# EAGLE schematic Josytick Rev J (EAGLE 9.6.2)
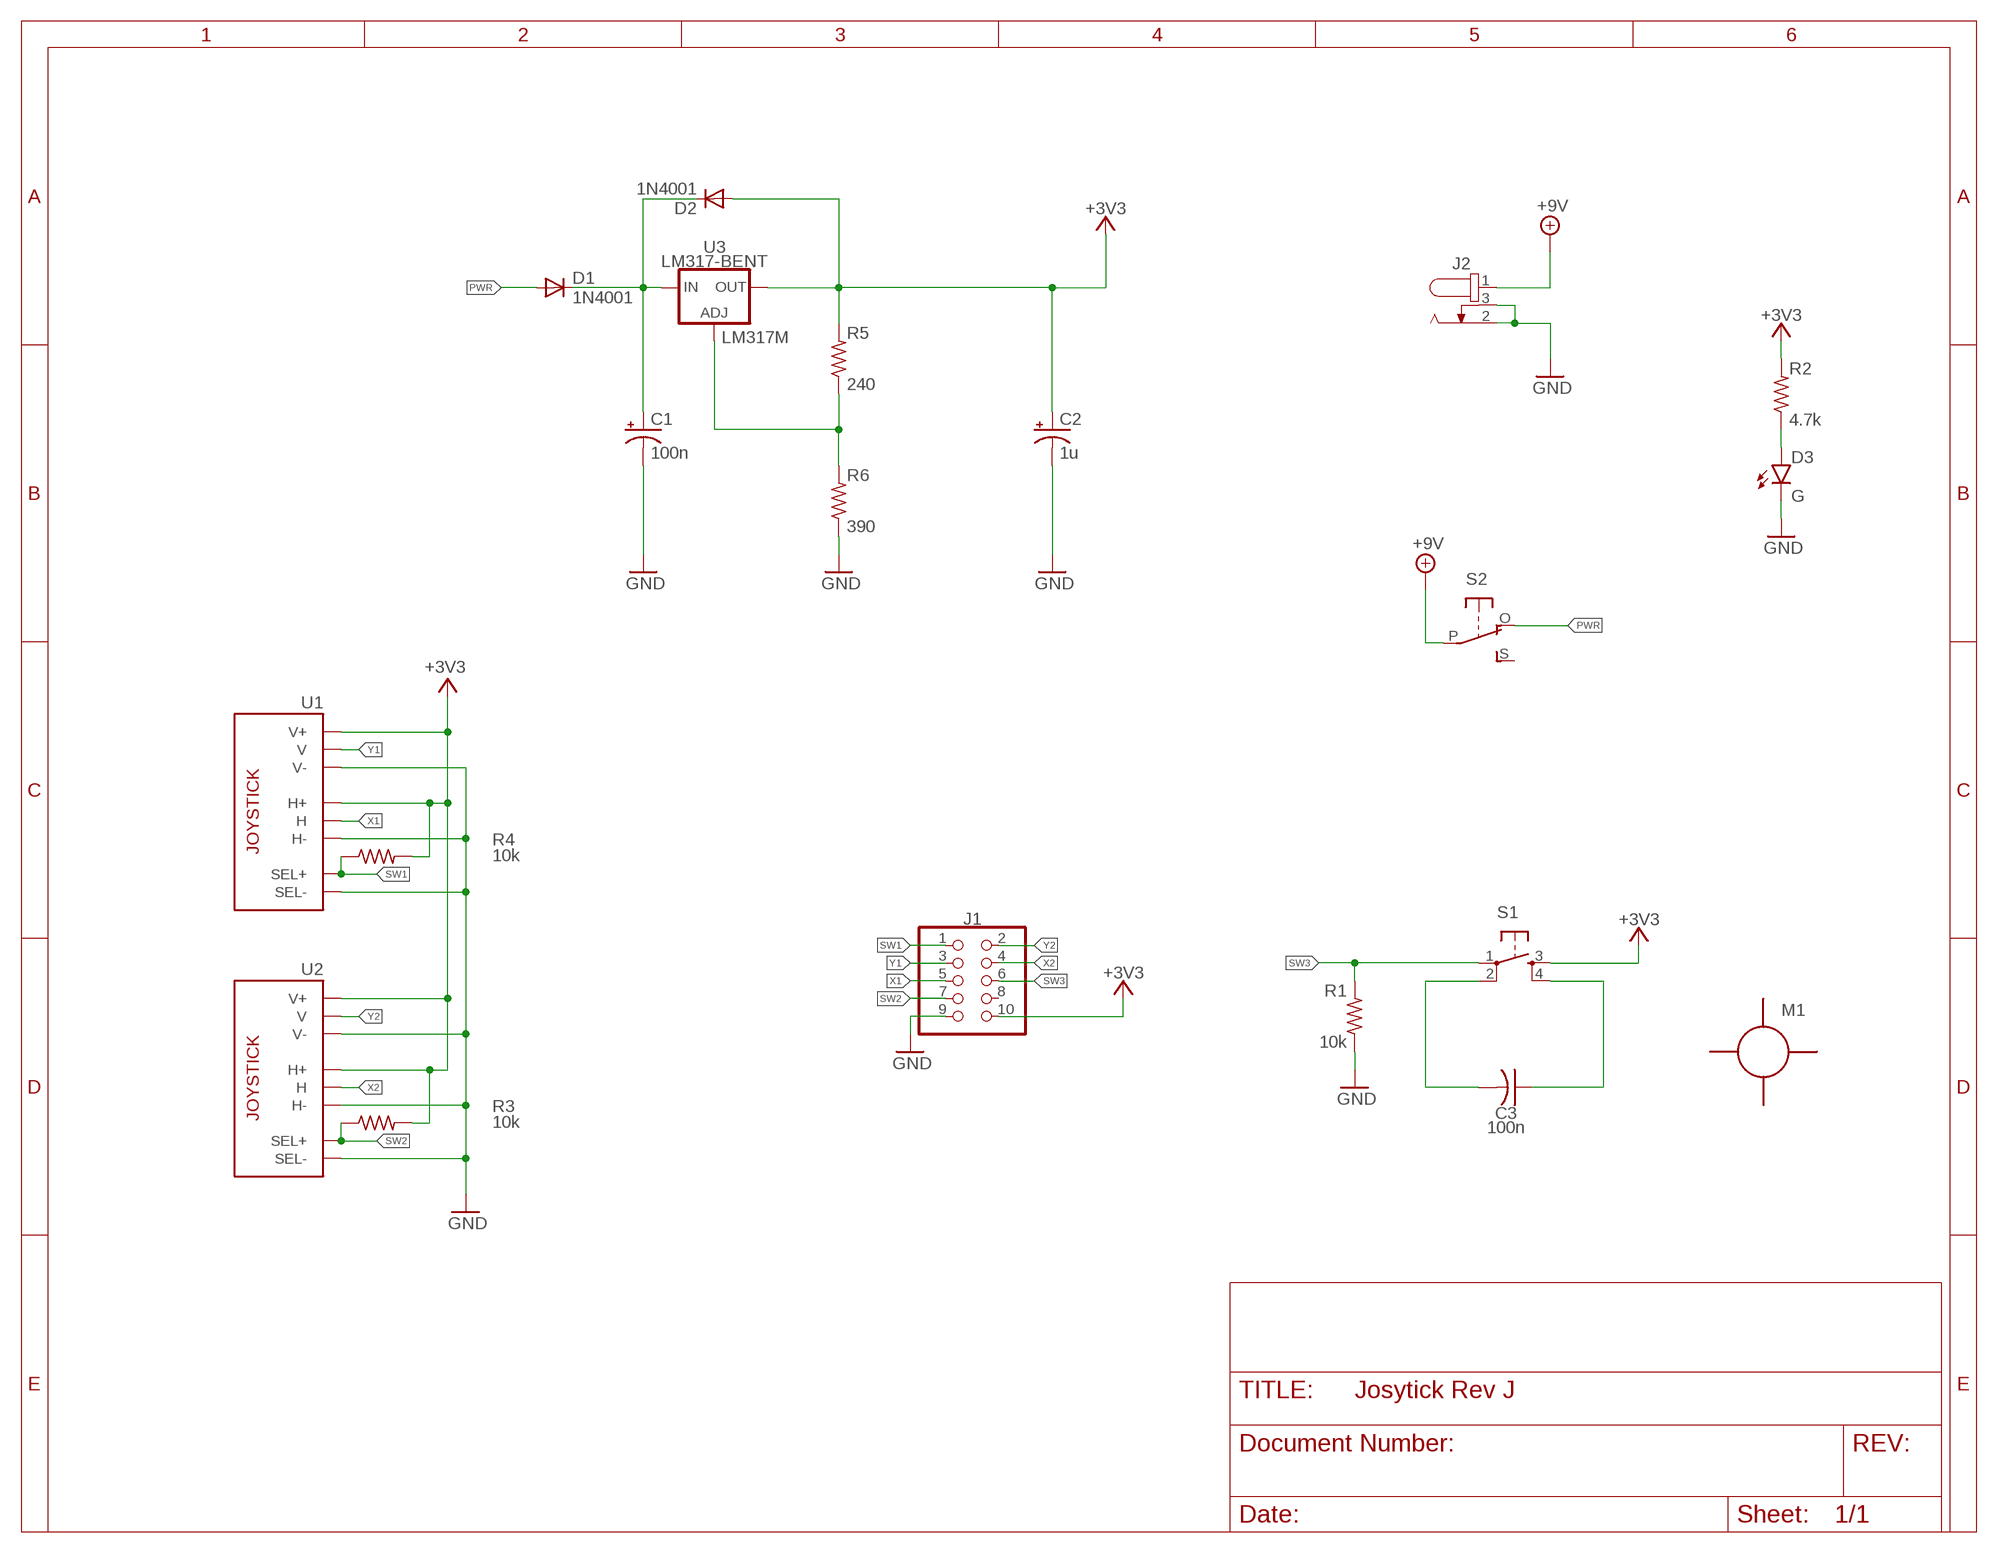
[diagram p0: schematic, sheet 1]

## Parts
C1  100n  ELECTROLYTIC-CAPACITOR2-4  [E2-4]
C2  1u  ELECTROLYTIC-CAPACITOR2-4  [E2-4]
C3  100n  THT-CER-CAPACITOR  [C050-024X044]
D1  1N4001  1N4000  [DO41-10]
D2  1N4001  1N4000  [DO41-10]
D3  G  LED  [LED5MM]
J1  RIBBON-2X5  [057-010-1]
J2  694106301002  [694106301002]
M1  9V-HOLDERM2.5  [9V-HOLDER-M2.5]
R1  10k  RESISTOR  [0207/10]
R2  4.7k  RESISTOR  [0207/10]
R3  10k  RESISTOR  [0207/10]
R4  10k  RESISTOR  [0207/10]
R5  240  RESISTOR  [0207/10]
R6  390  RESISTOR  [0207/10]
S1  TACTILE-BUTTON40XX  [B3F-40XX]
S2  SLIDE-SWITCHSIDE  [EG1270-90]
U1  JOYSTICK  [JOYSTICK]
U2  JOYSTICK  [JOYSTICK]
U3  LM317-BENT  LM317BENT  [T03B]

## Nets
+3V3: C2.+ D2.A J1.10 R2.2 R3.2 R4.2 R5.2 S1.3(S) U1.H1(H+) U1.V1(V+) U2.H1(H+) U2.V1(V+) U3.2(OUT)
+9V: J2.1 S2.P
GND: C1.- C2.- D3.K(C) J1.9 J2.2 J2.3 R1.1 R6.1 U1.B2A(SEL-) U1.H3(H-) U1.V3(V-) U2.B2A(SEL-) U2.H3(H-) U2.V3(V-)
N$1: R5.1 R6.2 U3.1(ADJ)
N$2: D3.A R2.1
N$3: C3.1 S1.4(S1)
N$4: C3.2 S1.2(P1)
N$5: C1.+ D1.C D2.C U3.3(IN)
PWR: D1.A S2.O
SW1: J1.1 R4.1 U1.B1A(SEL+)
SW2: J1.7 R3.1 U2.B1A(SEL+)
SW3: J1.6 R1.2 S1.1(P)
X1: J1.5 U1.H2(H)
X2: J1.4 U2.H2(H)
Y1: J1.3 U1.V2(V)
Y2: J1.2 U2.V2(V)
Unconnected: J1.8 S2.S

## Library data of the parts
C1 C2 = Quantum Projects:ELECTROLYTIC-CAPACITOR
C3 = Quantum Projects:THT-CER-CAPACITOR
D1 D2 = Quantum Projects:1N4000
D3 = Quantum Projects:LED
J1 = Quantum Projects:RIBBON-2X5
J2 = Wurth_Connectors_WR-DC:694106301002: WR-DC DC Power Jack Right Angled (6.4) KIND PROPERTIES Quality Class 5 000 Mating cycles Type Right Angled MATERIAL PROPERTIES Insulator Material PA66 Insulator Flammability Rating UL94 V-0 Color Black Contact Material Copper Alloy Contact Type Stamped Center Pin Plating Gold Center Pin Terminal Plating Tin Tip Spring Material Tin Shunt Terminal Plating Tin GENERAL INFORMATION Operating Temperature -40 up to +85 °C Compliance RoHS ELECTRICAL PROPERTIES IR 1 5 A Working Voltage 30 V (AC) Withstanding Voltage 500 V (AC) Contact Resistance 50 mΩ RISO 100 MΩ PACKAGING PROPERTIES Packaging Bag <https://katalog.we-online.com/media/images/v2/o59009v209%20Family_WR-DC_DC_Power_Jack_Right_Angled_THT_69410x301002.jpg> Details see: https://katalog.we-online.com/en/em/DC_RIGHT_ANGLED_6_4_69410X301002 Updated by Ella Wu 2019-11-01 2019(C) Wurth Elektronik; DATASHEET-URL: https://katalog.we-online.com/em/datasheet/694106301002.pdf; IR: 5A; MOUNT: THT; PART-NUMBER: 694106301002; TYPE: Right Angled; WORKING-VOLTAGE: 30V(AC)
M1 = Quantum Projects:9V-HOLDER
R1-R6 = Quantum Projects:RESISTOR
S1 = Quantum Projects:TACTILE-BUTTON; SPICEPREFIX: S
S2 = Quantum Projects:SLIDE-SWITCH
U1 U2 = Quantum Projects:JOYSTICK
U3 = Quantum Projects:LM317; PARTNUMBER: LM317M